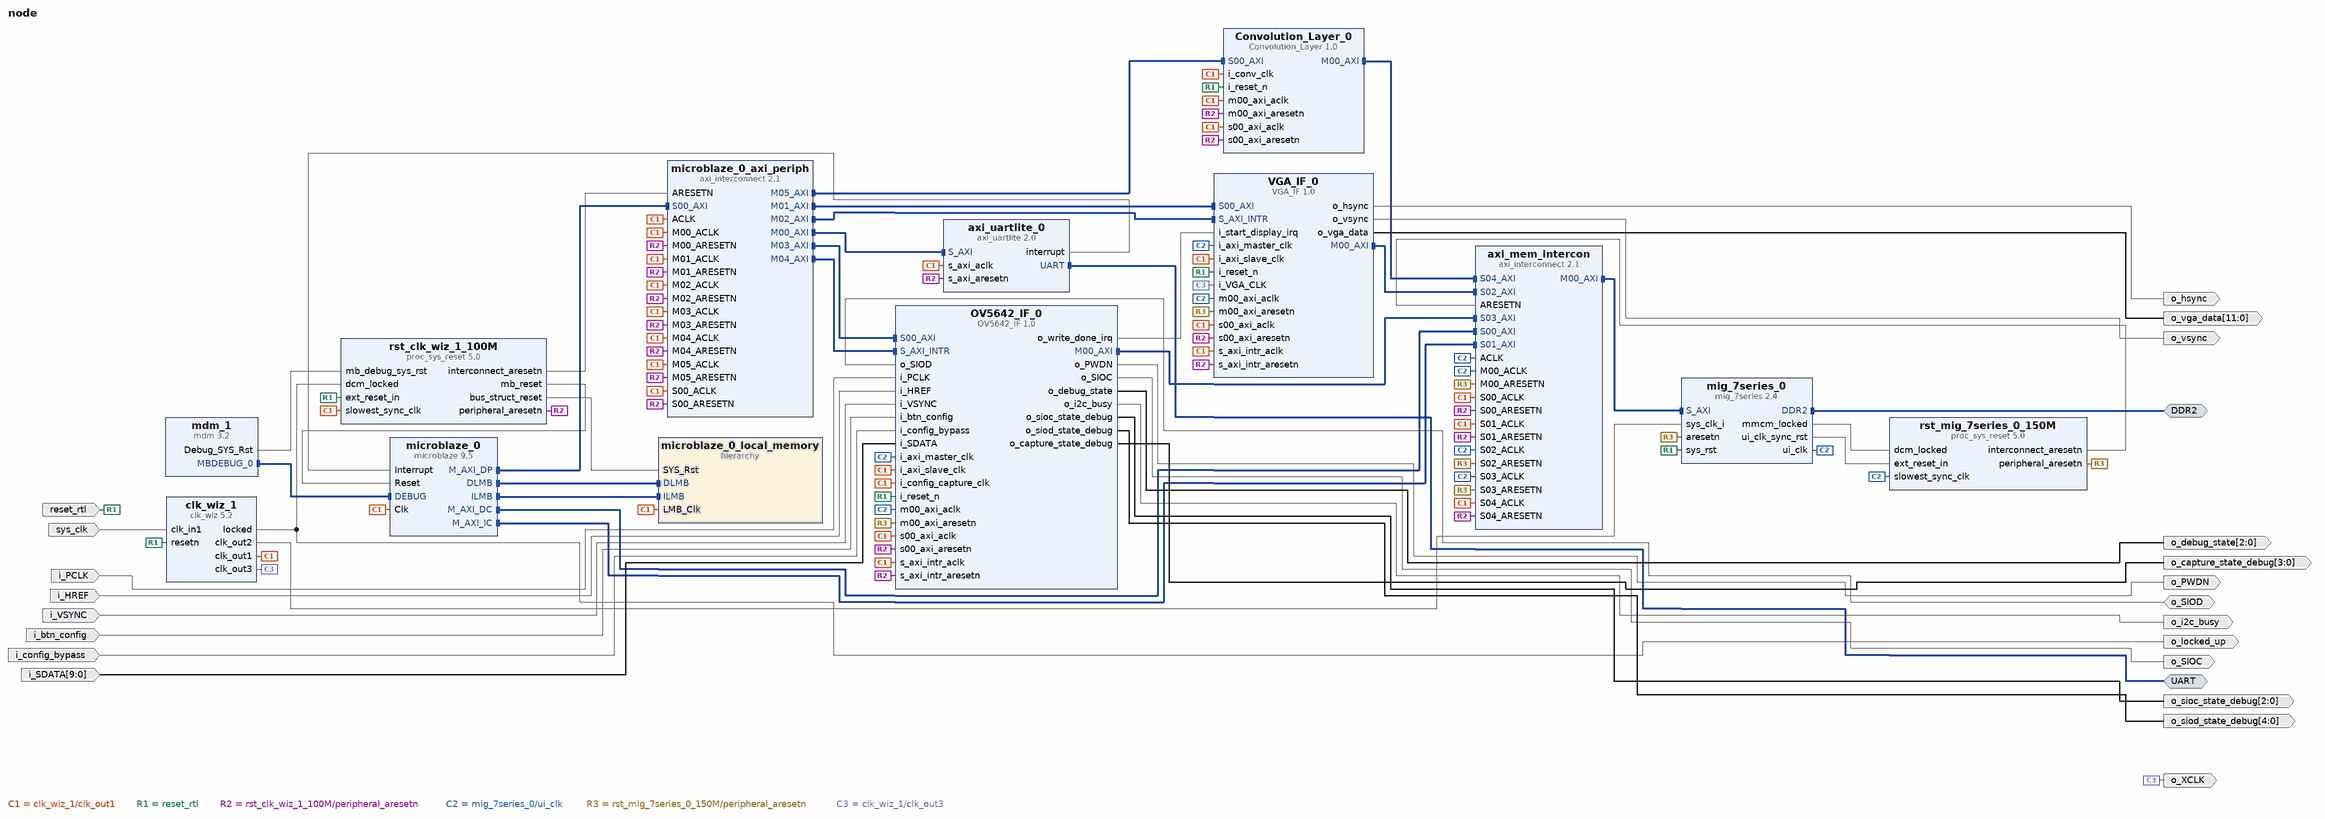
[diagram p0: block diagram of the top level]
# Vivado block design node, Vivado 2015.4
create_bd_design node

create_bd_intf_port -mode Master -vlnv xilinx.com:interface:ddrx_rtl:1.0 DDR2
create_bd_intf_port -mode Master -vlnv xilinx.com:interface:uart_rtl:1.0 UART
create_bd_port -dir O o_locked_up
create_bd_port -dir I -type clk sys_clk
set_property -dict {CONFIG.FREQ_HZ 100000000} [get_bd_ports sys_clk]
create_bd_port -dir I -type rst reset_rtl
set_property -dict {CONFIG.POLARITY ACTIVE_LOW} [get_bd_ports reset_rtl]
create_bd_port -dir O -type clk o_XCLK
create_bd_port -dir IO o_SIOD
create_bd_port -dir O o_hsync
create_bd_port -dir O o_vsync
create_bd_port -dir O -from 11 -to 0 o_vga_data
create_bd_port -dir I i_PCLK
create_bd_port -dir I i_HREF
create_bd_port -dir I i_VSYNC
create_bd_port -dir I i_btn_config
create_bd_port -dir I i_config_bypass
create_bd_port -dir I -from 9 -to 0 i_SDATA
create_bd_port -dir O o_PWDN
create_bd_port -dir O o_SIOC
create_bd_port -dir O -from 2 -to 0 o_debug_state
create_bd_port -dir O o_i2c_busy
create_bd_port -dir O -from 2 -to 0 o_sioc_state_debug
create_bd_port -dir O -from 4 -to 0 o_siod_state_debug
create_bd_port -dir O -from 3 -to 0 o_capture_state_debug

create_bd_cell -type ip -vlnv xilinx.com:ip:microblaze:9.5 microblaze_0
set_property -dict [list \
  CONFIG.C_D_AXI 1 \
  CONFIG.C_D_LMB 1 \
  CONFIG.C_I_LMB 1 \
  CONFIG.C_DEBUG_ENABLED 1 \
  CONFIG.C_USE_ICACHE 1 \
  CONFIG.C_CACHE_BYTE_SIZE 16384 \
  CONFIG.C_USE_DCACHE 1 \
  CONFIG.C_DCACHE_BYTE_SIZE 16384 \
] [get_bd_cells microblaze_0]
create_bd_cell -type hier microblaze_0_local_memory
create_bd_cell -type ip -vlnv xilinx.com:ip:mdm:3.2 mdm_1
create_bd_cell -type ip -vlnv xilinx.com:ip:clk_wiz:5.2 clk_wiz_1
set_property -dict [list \
  CONFIG.CLKOUT2_USED true \
  CONFIG.CLKOUT3_USED true \
  CONFIG.NUM_OUT_CLKS 3 \
  CONFIG.CLKOUT2_REQUESTED_OUT_FREQ 200 \
  CONFIG.CLKOUT3_REQUESTED_OUT_FREQ 25 \
  CONFIG.PRIM_SOURCE Single_ended_clock_capable_pin \
  CONFIG.RESET_PORT resetn \
  CONFIG.MMCM_DIVCLK_DIVIDE 1 \
  CONFIG.MMCM_CLKOUT1_DIVIDE 5 \
  CONFIG.MMCM_CLKOUT2_DIVIDE 40 \
  CONFIG.RESET_TYPE ACTIVE_LOW \
  CONFIG.CLKOUT2_JITTER 114.829 \
  CONFIG.CLKOUT2_PHASE_ERROR 98.575 \
  CONFIG.CLKOUT3_JITTER 175.402 \
  CONFIG.CLKOUT3_PHASE_ERROR 98.575 \
] [get_bd_cells clk_wiz_1]
create_bd_cell -type ip -vlnv xilinx.com:ip:proc_sys_reset:5.0 rst_clk_wiz_1_100M
create_bd_cell -type ip -vlnv xilinx.com:ip:axi_uartlite:2.0 axi_uartlite_0
create_bd_cell -type ip -vlnv xilinx.com:ip:axi_interconnect:2.1 microblaze_0_axi_periph
set_property -dict {CONFIG.NUM_MI 6} [get_bd_cells microblaze_0_axi_periph]
create_bd_cell -type ip -vlnv xilinx.com:ip:mig_7series:2.4 mig_7series_0
set_property -dict [list \
  CONFIG.XML_INPUT_FILE mig_a.prj \
  CONFIG.RESET_BOARD_INTERFACE Custom \
  CONFIG.BOARD_MIG_PARAM Custom \
] [get_bd_cells mig_7series_0]
create_bd_cell -type ip -vlnv xilinx.com:ip:axi_interconnect:2.1 axi_mem_intercon
set_property -dict {CONFIG.NUM_SI 5 CONFIG.NUM_MI 1} [get_bd_cells axi_mem_intercon]
create_bd_cell -type ip -vlnv xilinx.com:ip:proc_sys_reset:5.0 rst_mig_7series_0_150M
create_bd_cell -type ip -vlnv xilinx.com:user:OV5642_IF:1.0 OV5642_IF_0
set_property -dict {CONFIG.C_M00_AXI_TARGET_SLAVE_BASE_ADDR 0x80000000} [get_bd_cells OV5642_IF_0]
create_bd_cell -type ip -vlnv xilinx.com:user:VGA_IF:1.0 VGA_IF_0
set_property -dict {CONFIG.C_M00_AXI_TARGET_SLAVE_BASE_ADDR 0x80000000} [get_bd_cells VGA_IF_0]
create_bd_cell -type ip -vlnv xilinx.com:user:Convolution_Layer:1.0 Convolution_Layer_0

# ---- hierarchy /microblaze_0_local_memory ----
current_bd_instance /microblaze_0_local_memory
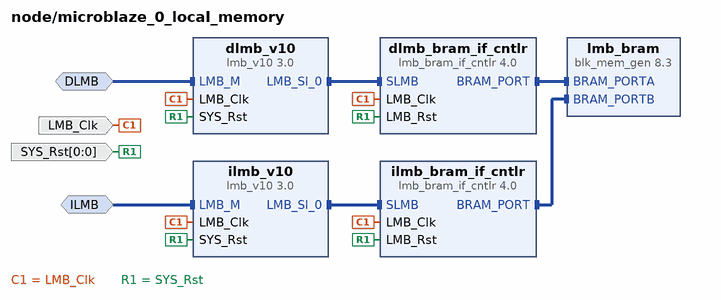
[diagram p1: block diagram inside /microblaze_0_local_memory]
create_bd_intf_pin -mode MirroredMaster -vlnv xilinx.com:interface:lmb_rtl:1.0 DLMB
create_bd_intf_pin -mode MirroredMaster -vlnv xilinx.com:interface:lmb_rtl:1.0 ILMB
create_bd_pin -dir I -type clk LMB_Clk
create_bd_pin -dir I -from 0 -to 0 -type rst SYS_Rst

create_bd_cell -type ip -vlnv xilinx.com:ip:lmb_v10:3.0 dlmb_v10
create_bd_cell -type ip -vlnv xilinx.com:ip:lmb_v10:3.0 ilmb_v10
create_bd_cell -type ip -vlnv xilinx.com:ip:lmb_bram_if_cntlr:4.0 dlmb_bram_if_cntlr
set_property -dict {CONFIG.C_ECC 0} [get_bd_cells dlmb_bram_if_cntlr]
create_bd_cell -type ip -vlnv xilinx.com:ip:lmb_bram_if_cntlr:4.0 ilmb_bram_if_cntlr
set_property -dict {CONFIG.C_ECC 0} [get_bd_cells ilmb_bram_if_cntlr]
create_bd_cell -type ip -vlnv xilinx.com:ip:blk_mem_gen:8.3 lmb_bram
set_property -dict {CONFIG.Memory_Type True_Dual_Port_RAM CONFIG.use_bram_block BRAM_Controller} [get_bd_cells lmb_bram]

# ---- connections ----

current_bd_instance /microblaze_0_local_memory
connect_bd_intf_net -intf_net microblaze_0_dlmb_bus [get_bd_intf_pins dlmb_v10/LMB_Sl_0] [get_bd_intf_pins dlmb_bram_if_cntlr/SLMB]
connect_bd_intf_net -intf_net microblaze_0_ilmb_bus [get_bd_intf_pins ilmb_v10/LMB_Sl_0] [get_bd_intf_pins ilmb_bram_if_cntlr/SLMB]
connect_bd_intf_net -intf_net microblaze_0_dlmb_cntlr [get_bd_intf_pins dlmb_bram_if_cntlr/BRAM_PORT] [get_bd_intf_pins lmb_bram/BRAM_PORTA]
connect_bd_intf_net -intf_net microblaze_0_ilmb_cntlr [get_bd_intf_pins ilmb_bram_if_cntlr/BRAM_PORT] [get_bd_intf_pins lmb_bram/BRAM_PORTB]
connect_bd_intf_net -intf_net microblaze_0_dlmb [get_bd_intf_pins DLMB] [get_bd_intf_pins dlmb_v10/LMB_M]
connect_bd_intf_net -intf_net microblaze_0_ilmb [get_bd_intf_pins ILMB] [get_bd_intf_pins ilmb_v10/LMB_M]
connect_bd_net -net microblaze_0_Clk [get_bd_pins LMB_Clk] \
  [get_bd_pins dlmb_v10/LMB_Clk] [get_bd_pins dlmb_bram_if_cntlr/LMB_Clk] [get_bd_pins ilmb_v10/LMB_Clk] \
  [get_bd_pins ilmb_bram_if_cntlr/LMB_Clk]
connect_bd_net [get_bd_pins SYS_Rst] \
  [get_bd_pins dlmb_v10/SYS_Rst] [get_bd_pins dlmb_bram_if_cntlr/LMB_Rst] [get_bd_pins ilmb_v10/SYS_Rst] \
  [get_bd_pins ilmb_bram_if_cntlr/LMB_Rst]

current_bd_instance /
connect_bd_intf_net [get_bd_intf_pins microblaze_0/DLMB] [get_bd_intf_pins microblaze_0_local_memory/DLMB]
connect_bd_intf_net [get_bd_intf_pins microblaze_0/ILMB] [get_bd_intf_pins microblaze_0_local_memory/ILMB]
connect_bd_intf_net [get_bd_intf_pins mdm_1/MBDEBUG_0] [get_bd_intf_pins microblaze_0/DEBUG]
connect_bd_intf_net [get_bd_intf_pins microblaze_0/M_AXI_DP] [get_bd_intf_pins microblaze_0_axi_periph/S00_AXI]
connect_bd_intf_net [get_bd_intf_pins microblaze_0_axi_periph/M00_AXI] [get_bd_intf_pins axi_uartlite_0/S_AXI]
connect_bd_intf_net [get_bd_intf_pins microblaze_0/M_AXI_DC] [get_bd_intf_pins axi_mem_intercon/S00_AXI]
connect_bd_intf_net [get_bd_intf_pins axi_mem_intercon/M00_AXI] [get_bd_intf_pins mig_7series_0/S_AXI]
connect_bd_intf_net [get_bd_intf_pins microblaze_0/M_AXI_IC] [get_bd_intf_pins axi_mem_intercon/S01_AXI]
connect_bd_intf_net [get_bd_intf_pins VGA_IF_0/M00_AXI] [get_bd_intf_pins axi_mem_intercon/S02_AXI]
connect_bd_intf_net [get_bd_intf_pins microblaze_0_axi_periph/M01_AXI] [get_bd_intf_pins VGA_IF_0/S00_AXI]
connect_bd_intf_net [get_bd_intf_pins microblaze_0_axi_periph/M02_AXI] [get_bd_intf_pins VGA_IF_0/S_AXI_INTR]
connect_bd_intf_net [get_bd_intf_pins OV5642_IF_0/M00_AXI] [get_bd_intf_pins axi_mem_intercon/S03_AXI]
connect_bd_intf_net [get_bd_intf_pins microblaze_0_axi_periph/M03_AXI] [get_bd_intf_pins OV5642_IF_0/S00_AXI]
connect_bd_intf_net [get_bd_intf_pins microblaze_0_axi_periph/M04_AXI] [get_bd_intf_pins OV5642_IF_0/S_AXI_INTR]
connect_bd_intf_net [get_bd_intf_pins microblaze_0_axi_periph/M05_AXI] [get_bd_intf_pins Convolution_Layer_0/S00_AXI]
connect_bd_intf_net [get_bd_intf_pins Convolution_Layer_0/M00_AXI] [get_bd_intf_pins axi_mem_intercon/S04_AXI]
connect_bd_intf_net [get_bd_intf_ports DDR2] [get_bd_intf_pins mig_7series_0/DDR2]
connect_bd_intf_net [get_bd_intf_ports UART] [get_bd_intf_pins axi_uartlite_0/UART]
connect_bd_net -net microblaze_0_Clk [get_bd_pins clk_wiz_1/clk_out1] \
  [get_bd_pins microblaze_0/Clk] [get_bd_pins rst_clk_wiz_1_100M/slowest_sync_clk] [get_bd_pins axi_uartlite_0/s_axi_aclk] \
  [get_bd_pins OV5642_IF_0/i_axi_slave_clk] [get_bd_pins OV5642_IF_0/i_config_capture_clk] \
  [get_bd_pins OV5642_IF_0/s00_axi_aclk] [get_bd_pins OV5642_IF_0/s_axi_intr_aclk] [get_bd_pins VGA_IF_0/i_axi_slave_clk] \
  [get_bd_pins VGA_IF_0/s_axi_intr_aclk] [get_bd_pins VGA_IF_0/s00_axi_aclk] [get_bd_pins microblaze_0_local_memory/LMB_Clk] \
  [get_bd_pins microblaze_0_axi_periph/S00_ACLK] [get_bd_pins microblaze_0_axi_periph/ACLK] \
  [get_bd_pins microblaze_0_axi_periph/M00_ACLK] [get_bd_pins axi_mem_intercon/S00_ACLK] \
  [get_bd_pins axi_mem_intercon/S01_ACLK] [get_bd_pins microblaze_0_axi_periph/M01_ACLK] \
  [get_bd_pins microblaze_0_axi_periph/M02_ACLK] [get_bd_pins microblaze_0_axi_periph/M03_ACLK] \
  [get_bd_pins microblaze_0_axi_periph/M04_ACLK] [get_bd_pins microblaze_0_axi_periph/M05_ACLK] \
  [get_bd_pins axi_mem_intercon/S04_ACLK] [get_bd_pins Convolution_Layer_0/i_conv_clk] \
  [get_bd_pins Convolution_Layer_0/s00_axi_aclk] [get_bd_pins Convolution_Layer_0/m00_axi_aclk]
connect_bd_net [get_bd_pins clk_wiz_1/locked] [get_bd_ports o_locked_up] [get_bd_pins rst_clk_wiz_1_100M/dcm_locked]
connect_bd_net [get_bd_pins rst_clk_wiz_1_100M/mb_reset] [get_bd_pins microblaze_0/Reset]
connect_bd_net [get_bd_pins rst_clk_wiz_1_100M/bus_struct_reset] [get_bd_pins microblaze_0_local_memory/SYS_Rst]
connect_bd_net [get_bd_pins mdm_1/Debug_SYS_Rst] [get_bd_pins rst_clk_wiz_1_100M/mb_debug_sys_rst]
connect_bd_net [get_bd_ports sys_clk] [get_bd_pins clk_wiz_1/clk_in1]
connect_bd_net [get_bd_ports reset_rtl] \
  [get_bd_pins clk_wiz_1/resetn] [get_bd_pins rst_clk_wiz_1_100M/ext_reset_in] [get_bd_pins mig_7series_0/sys_rst] \
  [get_bd_pins OV5642_IF_0/i_reset_n] [get_bd_pins VGA_IF_0/i_reset_n] [get_bd_pins Convolution_Layer_0/i_reset_n]
connect_bd_net [get_bd_pins rst_clk_wiz_1_100M/peripheral_aresetn] \
  [get_bd_pins axi_uartlite_0/s_axi_aresetn] [get_bd_pins OV5642_IF_0/s00_axi_aresetn] \
  [get_bd_pins OV5642_IF_0/s_axi_intr_aresetn] [get_bd_pins VGA_IF_0/s_axi_intr_aresetn] \
  [get_bd_pins VGA_IF_0/s00_axi_aresetn] [get_bd_pins microblaze_0_axi_periph/S00_ARESETN] \
  [get_bd_pins microblaze_0_axi_periph/M00_ARESETN] [get_bd_pins axi_mem_intercon/S00_ARESETN] \
  [get_bd_pins axi_mem_intercon/S01_ARESETN] [get_bd_pins microblaze_0_axi_periph/M01_ARESETN] \
  [get_bd_pins microblaze_0_axi_periph/M02_ARESETN] [get_bd_pins microblaze_0_axi_periph/M03_ARESETN] \
  [get_bd_pins microblaze_0_axi_periph/M04_ARESETN] [get_bd_pins microblaze_0_axi_periph/M05_ARESETN] \
  [get_bd_pins axi_mem_intercon/S04_ARESETN] [get_bd_pins Convolution_Layer_0/s00_axi_aresetn] \
  [get_bd_pins Convolution_Layer_0/m00_axi_aresetn]
connect_bd_net [get_bd_pins rst_clk_wiz_1_100M/interconnect_aresetn] [get_bd_pins microblaze_0_axi_periph/ARESETN]
connect_bd_net [get_bd_pins mig_7series_0/ui_clk] \
  [get_bd_pins rst_mig_7series_0_150M/slowest_sync_clk] [get_bd_pins OV5642_IF_0/i_axi_master_clk] \
  [get_bd_pins OV5642_IF_0/m00_axi_aclk] [get_bd_pins VGA_IF_0/i_axi_master_clk] [get_bd_pins VGA_IF_0/m00_axi_aclk] \
  [get_bd_pins axi_mem_intercon/ACLK] [get_bd_pins axi_mem_intercon/M00_ACLK] [get_bd_pins axi_mem_intercon/S02_ACLK] \
  [get_bd_pins axi_mem_intercon/S03_ACLK]
connect_bd_net [get_bd_pins mig_7series_0/mmcm_locked] [get_bd_pins rst_mig_7series_0_150M/dcm_locked]
connect_bd_net [get_bd_pins mig_7series_0/ui_clk_sync_rst] [get_bd_pins rst_mig_7series_0_150M/ext_reset_in]
connect_bd_net [get_bd_pins rst_mig_7series_0_150M/interconnect_aresetn] [get_bd_pins axi_mem_intercon/ARESETN]
connect_bd_net [get_bd_pins rst_mig_7series_0_150M/peripheral_aresetn] \
  [get_bd_pins mig_7series_0/aresetn] [get_bd_pins OV5642_IF_0/m00_axi_aresetn] [get_bd_pins VGA_IF_0/m00_axi_aresetn] \
  [get_bd_pins axi_mem_intercon/M00_ARESETN] [get_bd_pins axi_mem_intercon/S02_ARESETN] \
  [get_bd_pins axi_mem_intercon/S03_ARESETN]
connect_bd_net [get_bd_pins clk_wiz_1/clk_out2] [get_bd_pins mig_7series_0/sys_clk_i]
connect_bd_net [get_bd_pins clk_wiz_1/clk_out3] [get_bd_ports o_XCLK] [get_bd_pins VGA_IF_0/i_VGA_CLK]
connect_bd_net [get_bd_ports o_SIOD] [get_bd_pins OV5642_IF_0/o_SIOD]
connect_bd_net [get_bd_pins VGA_IF_0/o_hsync] [get_bd_ports o_hsync]
connect_bd_net [get_bd_pins VGA_IF_0/o_vsync] [get_bd_ports o_vsync]
connect_bd_net [get_bd_pins VGA_IF_0/o_vga_data] [get_bd_ports o_vga_data]
connect_bd_net [get_bd_ports i_PCLK] [get_bd_pins OV5642_IF_0/i_PCLK]
connect_bd_net [get_bd_ports i_HREF] [get_bd_pins OV5642_IF_0/i_HREF]
connect_bd_net [get_bd_ports i_VSYNC] [get_bd_pins OV5642_IF_0/i_VSYNC]
connect_bd_net [get_bd_ports i_btn_config] [get_bd_pins OV5642_IF_0/i_btn_config]
connect_bd_net [get_bd_ports i_config_bypass] [get_bd_pins OV5642_IF_0/i_config_bypass]
connect_bd_net [get_bd_ports i_SDATA] [get_bd_pins OV5642_IF_0/i_SDATA]
connect_bd_net [get_bd_pins OV5642_IF_0/o_PWDN] [get_bd_ports o_PWDN]
connect_bd_net [get_bd_pins OV5642_IF_0/o_SIOC] [get_bd_ports o_SIOC]
connect_bd_net [get_bd_pins OV5642_IF_0/o_write_done_irq] [get_bd_pins VGA_IF_0/i_start_display_irq]
connect_bd_net [get_bd_pins OV5642_IF_0/o_debug_state] [get_bd_ports o_debug_state]
connect_bd_net [get_bd_pins OV5642_IF_0/o_i2c_busy] [get_bd_ports o_i2c_busy]
connect_bd_net [get_bd_pins OV5642_IF_0/o_sioc_state_debug] [get_bd_ports o_sioc_state_debug]
connect_bd_net [get_bd_pins OV5642_IF_0/o_siod_state_debug] [get_bd_ports o_siod_state_debug]
connect_bd_net [get_bd_pins OV5642_IF_0/o_capture_state_debug] [get_bd_ports o_capture_state_debug]
connect_bd_net [get_bd_pins axi_uartlite_0/interrupt] [get_bd_pins microblaze_0/Interrupt]

# ---- address map ----
assign_bd_address -offset 0x80000000 -range 128M -target_address_space [get_bd_addr_spaces Convolution_Layer_0/M00_AXI] [get_bd_addr_segs mig_7series_0/memmap/memaddr]
assign_bd_address -offset 0x00000000 -range 32K -target_address_space [get_bd_addr_spaces microblaze_0/Data] [get_bd_addr_segs microblaze_0_local_memory/dlmb_bram_if_cntlr/SLMB/Mem]
assign_bd_address -offset 0x40600000 -range 64K -target_address_space [get_bd_addr_spaces microblaze_0/Data] [get_bd_addr_segs axi_uartlite_0/S_AXI/Reg]
assign_bd_address -offset 0x44A00000 -range 64K -target_address_space [get_bd_addr_spaces microblaze_0/Data] [get_bd_addr_segs VGA_IF_0/S00_AXI/S00_AXI_reg]
assign_bd_address -offset 0x44A10000 -range 64K -target_address_space [get_bd_addr_spaces microblaze_0/Data] [get_bd_addr_segs VGA_IF_0/S_AXI_INTR/S_AXI_INTR_reg]
assign_bd_address -offset 0x44A20000 -range 64K -target_address_space [get_bd_addr_spaces microblaze_0/Data] [get_bd_addr_segs OV5642_IF_0/S00_AXI/S00_AXI_reg]
assign_bd_address -offset 0x44A30000 -range 64K -target_address_space [get_bd_addr_spaces microblaze_0/Data] [get_bd_addr_segs OV5642_IF_0/S_AXI_INTR/S_AXI_INTR_reg]
assign_bd_address -offset 0x44A40000 -range 64K -target_address_space [get_bd_addr_spaces microblaze_0/Data] [get_bd_addr_segs Convolution_Layer_0/S00_AXI/S00_AXI_reg]
assign_bd_address -offset 0x80000000 -range 128M -target_address_space [get_bd_addr_spaces microblaze_0/Data] [get_bd_addr_segs mig_7series_0/memmap/memaddr]
assign_bd_address -offset 0x00000000 -range 32K -target_address_space [get_bd_addr_spaces microblaze_0/Instruction] [get_bd_addr_segs microblaze_0_local_memory/ilmb_bram_if_cntlr/SLMB/Mem]
assign_bd_address -offset 0x80000000 -range 128M -target_address_space [get_bd_addr_spaces microblaze_0/Instruction] [get_bd_addr_segs mig_7series_0/memmap/memaddr]
assign_bd_address -offset 0x80000000 -range 128M -target_address_space [get_bd_addr_spaces OV5642_IF_0/M00_AXI] [get_bd_addr_segs mig_7series_0/memmap/memaddr]
assign_bd_address -offset 0x80000000 -range 128M -target_address_space [get_bd_addr_spaces VGA_IF_0/M00_AXI] [get_bd_addr_segs mig_7series_0/memmap/memaddr]

validate_bd_design
save_bd_design
